# Altium schematic sheet 主控模块.SchDoc
size A4
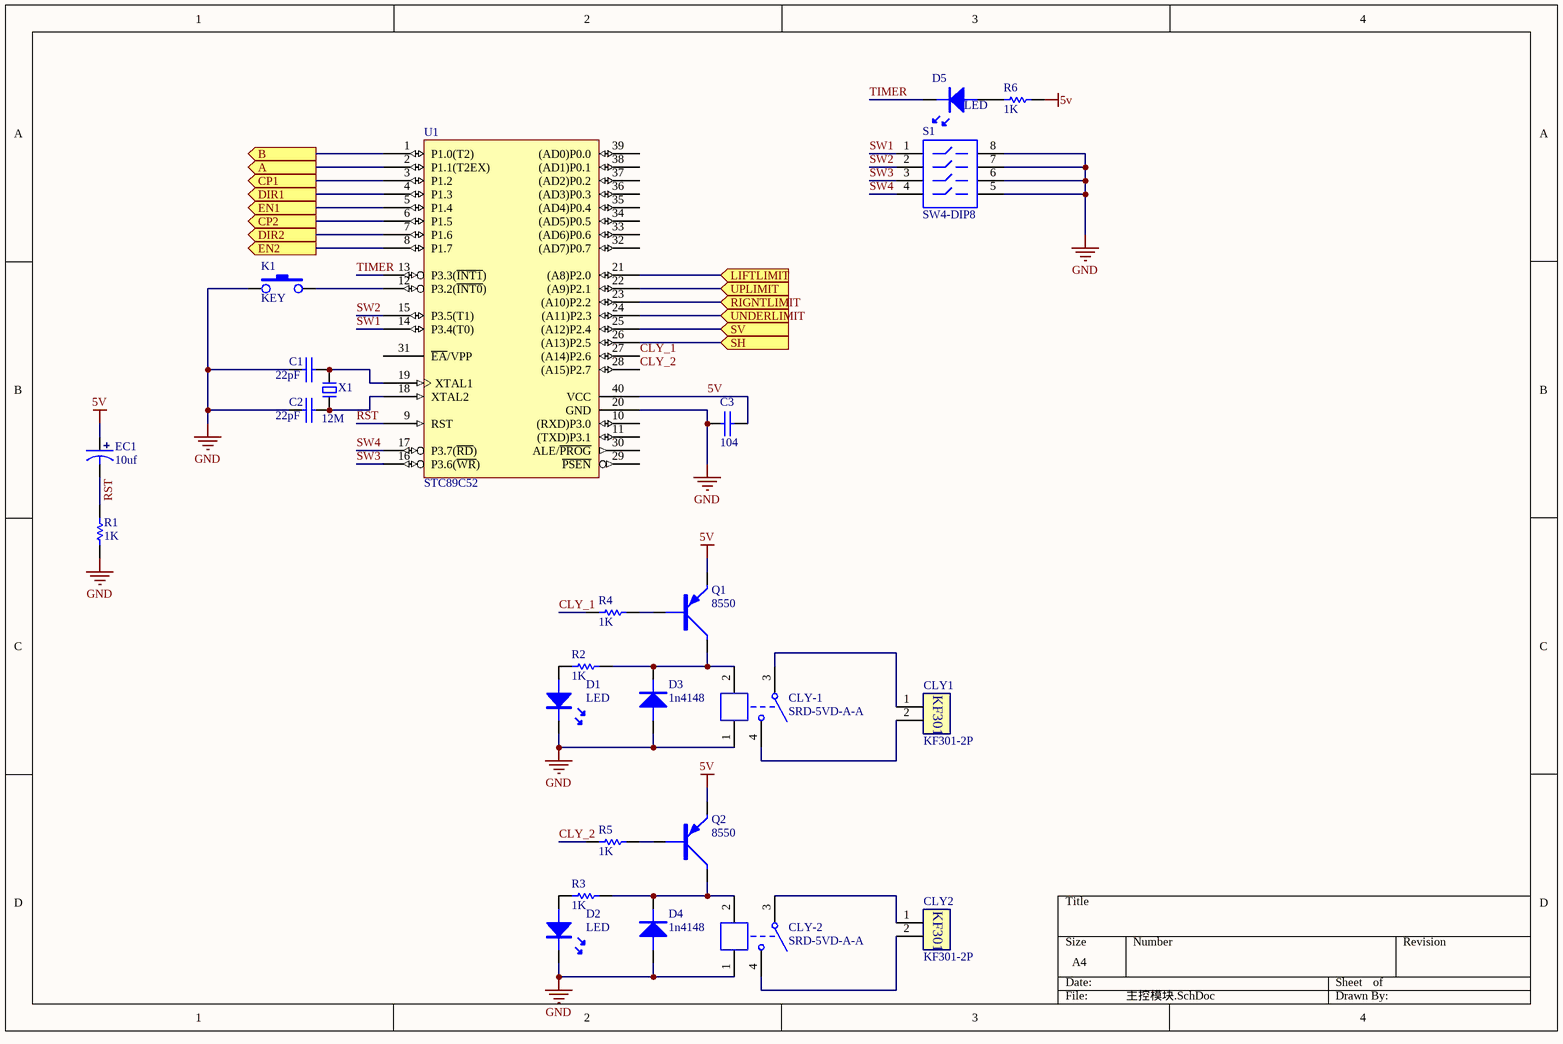
[diagram p0: 主控模块.SchDoc]

## Parts
C1  value 22pF  [0603C]  (hidden comment: CAP)
C2  value 22pF  [0603C]  (hidden comment: CAP)
C3  value 104  [0603C]  (hidden comment: CAP)
CLY1  KF301-2P  [KF301-5.0-2P]
CLY2  KF301-2P  [KF301-5.0-2P]
CLY-1  SRD-5VD-A-A  [SRD-A_B]
CLY-2  SRD-5VD-A-A  [SRD-A_B]
D1  LED  [LED3-YEL]
D2  LED  [LED3-YEL]
D3  1n4148  [DO-41V]
D4  1n4148  [DO-41V]
D5  LED  [LED3-YEL]
EC1  value 10uf  [DIP-EC5X11]  (hidden comment: SMD_ECAP)
K1  KEY  [DIP-6X6X5]
Q1  8550  [TO-92A]
Q2  8550  [TO-92A]
R1  value 1K  [0603R]  (hidden comment: RES)
R2  value 1K  [0603R]  (hidden comment: RES)
R3  value 1K  [0603R]  (hidden comment: RES)
R4  value 1K  [0603R]  (hidden comment: RES)
R5  value 1K  [0603R]  (hidden comment: RES)
R6  value 1K  [0603R]  (hidden comment: RES)
S1  SW4-DIP8  [DIP-4P_R]
U1  STC89C52  [DIP40]
X1  value 12M  [OSC HC-49S]  (hidden comment: XTAL-2P)

## Ports
A (out), B (out), CP1 (out), CP2 (out), DIR1 (out), DIR2 (out), EN1 (out), EN2 (out), LIFTLIMIT (in), RIGNTLIMIT (in), SH (in), SV (in), UNDERLIMIT (in), UPLIMIT (in)

## Nets
5V: C3.1 EC1.1 Q1.E Q2.E R6.2 U1.40(VCC)
GND: C1.2 C2.1 C3.2 CLY-1.1 CLY-2.1 D1.K D2.K D3.A D4.A K1.1 R1.1 S1.5 S1.6 S1.7 S1.8 U1.20(GND)
A: U1.2(P1.1(T2EX)) ; port A
B: U1.1(P1.0(T2)) ; port B
CLY_1: R4.1 U1.27((A14)P2.6)
CLY_2: R5.1 U1.28((A15)P2.7)
CP1: U1.3(P1.2) ; port CP1
CP2: U1.6(P1.5) ; port CP2
DIR1: U1.4(P1.3) ; port DIR1
DIR2: U1.7(P1.6) ; port DIR2
EN1: U1.5(P1.4) ; port EN1
EN2: U1.8(P1.7) ; port EN2
LIFTLIMIT: U1.21((A8)P2.0) ; port LIFTLIMIT
RIGNTLIMIT: U1.23((A10)P2.2) ; port RIGNTLIMIT
RST: EC1.2 R1.2 U1.9(RST)
SH: U1.26((A13)P2.5) ; port SH
SV: U1.25((A12)P2.4) ; port SV
SW1: S1.1 U1.14(P3.4(T0))
SW2: S1.2 U1.15(P3.5(T1))
SW3: S1.3 U1.16(P3.6(~{WR}))
SW4: S1.4 U1.17(P3.7(~{RD}))
TIMER: D5.K U1.13(P3.3(~{INT1}))
UNDERLIMIT: U1.24((A11)P2.3) ; port UNDERLIMIT
UPLIMIT: U1.22((A9)P2.1) ; port UPLIMIT
NetC1_1: C1.1 U1.19(XTAL1) X1.2
NetC2_2: C2.2 U1.18(XTAL2) X1.1
NetCLY1_1: CLY1.1 CLY-1.3
NetCLY1_2: CLY1.2 CLY-1.4
NetCLY2_1: CLY2.1 CLY-2.3
NetCLY2_2: CLY2.2 CLY-2.4
NetCLY-1_2: CLY-1.2 D3.K Q1.C R2.2
NetCLY-2_2: CLY-2.2 D4.K Q2.C R3.2
NetD1_A: D1.A R2.1
NetD2_A: D2.A R3.1
NetD5_A: D5.A R6.1
NetK1_3: K1.3 U1.12(P3.2(~{INT0}))
NetQ1_B: Q1.B R4.2
NetQ2_B: Q2.B R5.2

Not connected (* = marked no-connect by the designer): U1 10((RXD)P3.0) 11((TXD)P3.1) 29(~{PSEN}) 30(ALE/~{PROG}) 31(~{EA}/VPP) 32((AD7)P0.7) 33((AD6)P0.6) 34((AD5)P0.5) 35((AD4)P0.4) 36((AD3)P0.3) 37((AD2)P0.2) 38((AD1)P0.1) 39((AD0)P0.0)

## Notes on the sheet
- (in symbol KF301-2P) KF301

## Library data of the parts
C1-C3 = CAP: 无极性电容
CLY-1 CLY-2 = SRD-5VD-A-A: 一组常开
D3 D4 = DIODE: 普通二极管
EC1 = SMD_ECAP: 电解电容
Q1 Q2 = PNP: PNP三极管
X1 = XTAL-2P: 2脚无源脚晶振